# EAGLE design Movuino_Dongle_v0.94 (EAGLE 7.5.0)
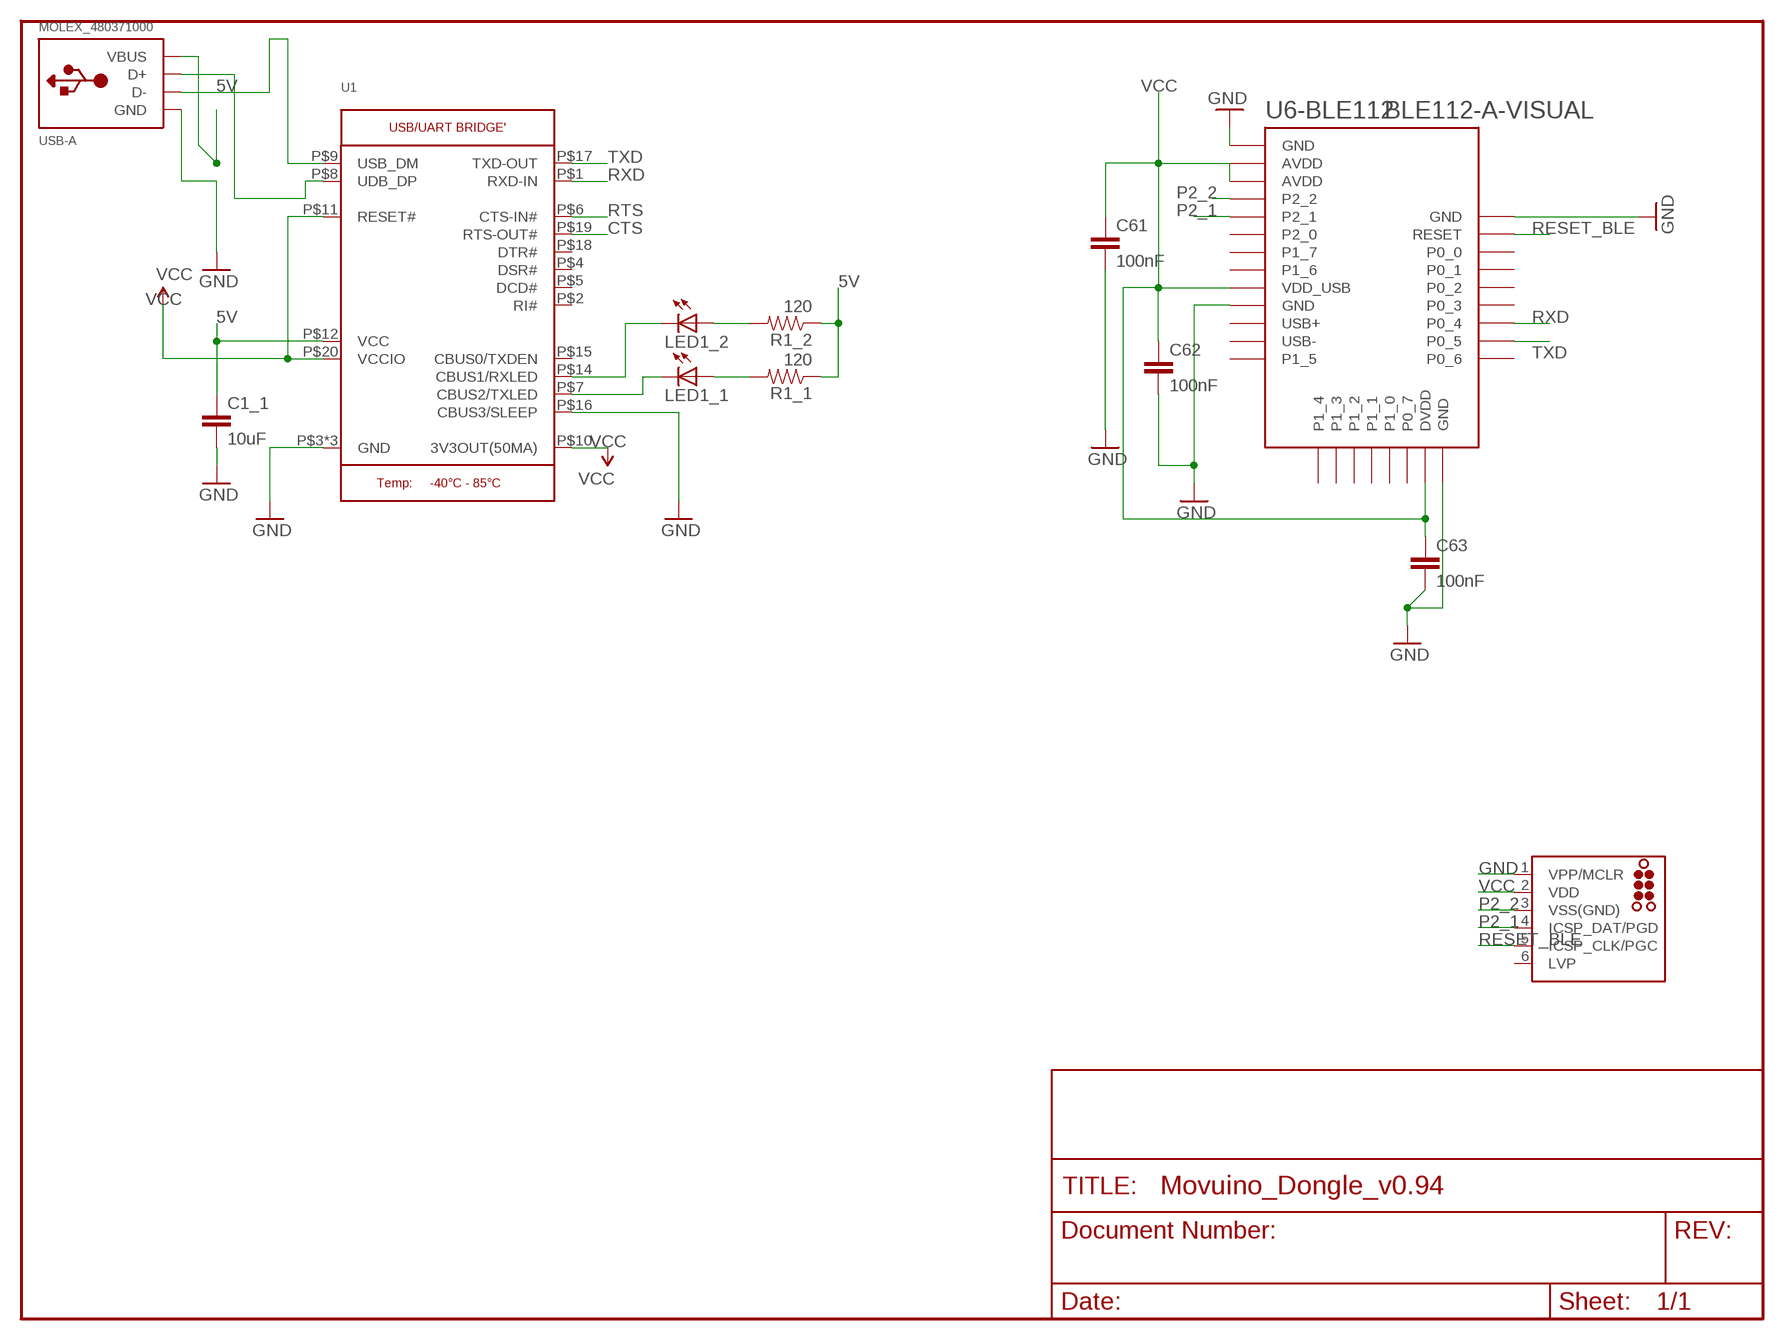
[diagram p0: schematic, sheet 1]

## Parts
C1_1  10uF  CAP0402-CAP  [0402-CAP]
C61  100nF  CAP0402-CAP  [0402-CAP]
C62  100nF  CAP0402-CAP  [0402-CAP]
C63  100nF  CAP0402-CAP  [0402-CAP]
J1  TC2030-MCP-NL  [TC2030-MCP-NL]
LED1_1  LED0603  [LED-0603]
LED1_2  LED0603  [LED-0603]
MOLEX_480371000  USB-A  [MOLEX_480371000]
R1_1  120  RESISTOR0402-RES  [0402-RES]
R1_2  120  RESISTOR0402-RES  [0402-RES]
U1  MICROBUILDER_FT231X  [MICROBUILDER_QFN20_4MM]
U6-BLE112  BLE112-A-VISUAL  [BLE112-A]

## Nets
5V: C1_1.1 MOLEX_480371000.1(VBUS) R1_1.1 R1_2.1 U1.P$12(VCC)
CTS: U1.P$19(RTS-OUT#)
GND: C1_1.2 C61.2 C62.2 C63.2 J1.1(VPP/MCLR) MOLEX_480371000.4(GND) U1.P$3(GND) U1.P$13(GND) U1.P$16(CBUS3/SLEEP) U1.P$21(GND) U6-BLE112.GND1(GND) U6-BLE112.GND2(GND) U6-BLE112.GND3(GND) U6-BLE112.GND4(GND)
N$2: MOLEX_480371000.3(D+) U1.P$8(UDB_DP)
N$7: MOLEX_480371000.2(D-) U1.P$9(USB_DM)
N$18: LED1_2.C U1.P$14(CBUS1/RXLED)
N$22: LED1_1.C U1.P$7(CBUS2/TXLED)
N$23: LED1_2.A R1_2.2
N$27: LED1_1.A R1_1.2
P2_1: J1.4(ICSP_DAT/PGD) U6-BLE112.P2_1
P2_2: J1.3(VSS(GND)) U6-BLE112.P2_2
RESET_BLE: J1.5(ICSP_CLK/PGC) U6-BLE112.RESET
RTS: U1.P$6(CTS-IN#)
RXD: U1.P$1(RXD-IN) U6-BLE112.P0_4
TXD: U1.P$17(TXD-OUT) U6-BLE112.P0_5
VCC: C61.1 C62.1 C63.1 J1.2(VDD) U1.P$10(3V3OUT(50MA)) U1.P$11(RESET#) U1.P$20(VCCIO) U6-BLE112.AVDD1(AVDD) U6-BLE112.AVDD2(AVDD) U6-BLE112.DVDD U6-BLE112.VDD_USB
Unconnected: J1.6(LVP) U1.P$2(RI#) U1.P$4(DSR#) U1.P$5(DCD#) U1.P$15(CBUS0/TXDEN) U1.P$18(DTR#) U6-BLE112.P0_0 U6-BLE112.P0_1 U6-BLE112.P0_2 U6-BLE112.P0_3 U6-BLE112.P0_6 U6-BLE112.P0_7 U6-BLE112.P1_0 U6-BLE112.P1_1 U6-BLE112.P1_2 U6-BLE112.P1_3 U6-BLE112.P1_4 U6-BLE112.P1_5 U6-BLE112.P1_6 U6-BLE112.P1_7 U6-BLE112.P2_0 U6-BLE112.USB+ U6-BLE112.USB-

## Library data of the parts
C1_1 C61-C63 = SparkFun:CAP: Capacitor Standard 0603 ceramic capacitor, and 0.1" leaded capacitor.
J1 = tag-connect:TC2030: TAG-CONNECT ICSP Connector Manufacturer: Tag-Connect <http://www.tag-connect.com> Cable for easy In-Circuit Serial Programming. Designed for Microchip ICD2, suitable for many others. Two variants - one "with legs" (for hands-free fit on PCB) and another "without legs" for quick programming. PAD Description 1 MCLR/Vpp 2 Vdd 3 GND 4 PGD (ISPDAT) 5 PGC (ISPCLK) 6 nc (used for LVP) ©2009 ROFA.cz - modified and updated by Robert Darlington ‹rdarlington@gmail.com›
LED1_1 LED1_2 = SparkFun-LED:LED: LEDs Standard schematic elements and footprints for 5mm, 3mm, 1206, and 0603 sized LEDs. 5mm - Spark Fun Electronics SKU : COM-00529 (and others)
MOLEX_480371000 = adafruit2:USB-A: USB type A 'plug' Used for things that can directly connect to a USB port, say USB key
R1_1 R1_2 = SparkFun:RESISTOR: Resistor Basic schematic elements and footprints for 0603, 1206, and PTH resistors.
U1 = FT231x:MICROBUILDER_FT231X: FT231X USB To Full Handshake UART IC
U6-BLE112 = BLE-Shield-1_0_0-B:BLE112-A-VISUAL: Bluetooth Low Energy single-mode module - Bluetooth 4.0, chip antenna

## Net classes
0 default: width 0.203 mm

## Board
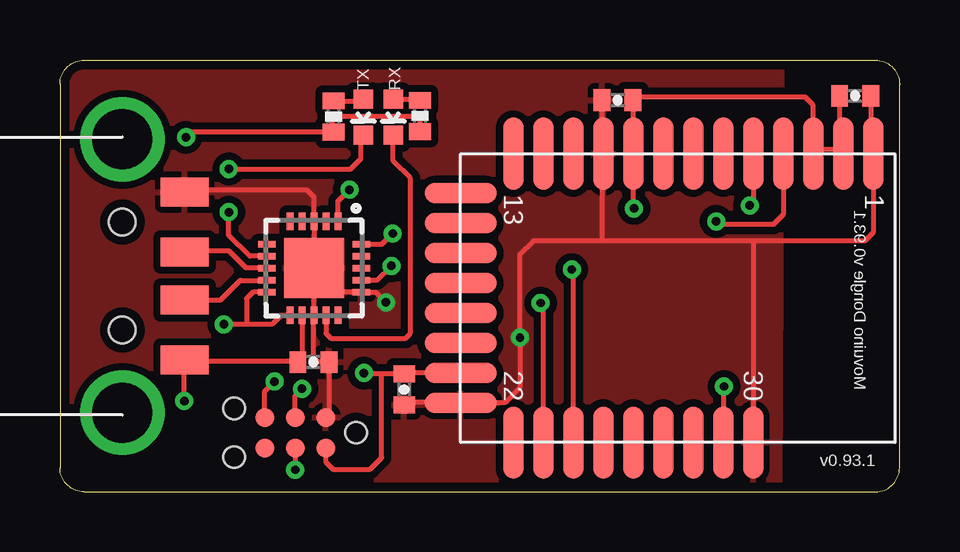
[diagram p1: board, top side]
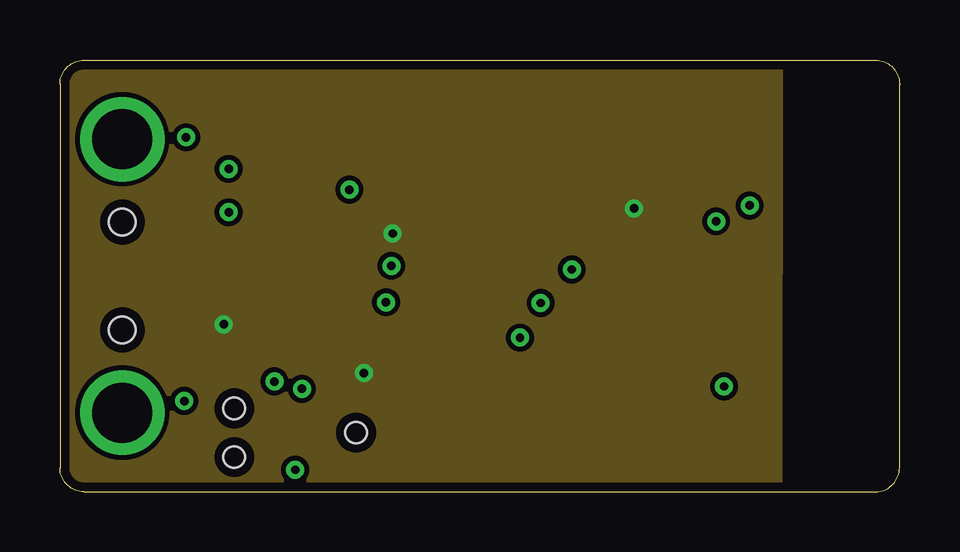
[diagram p2: board, inner layer VCC]
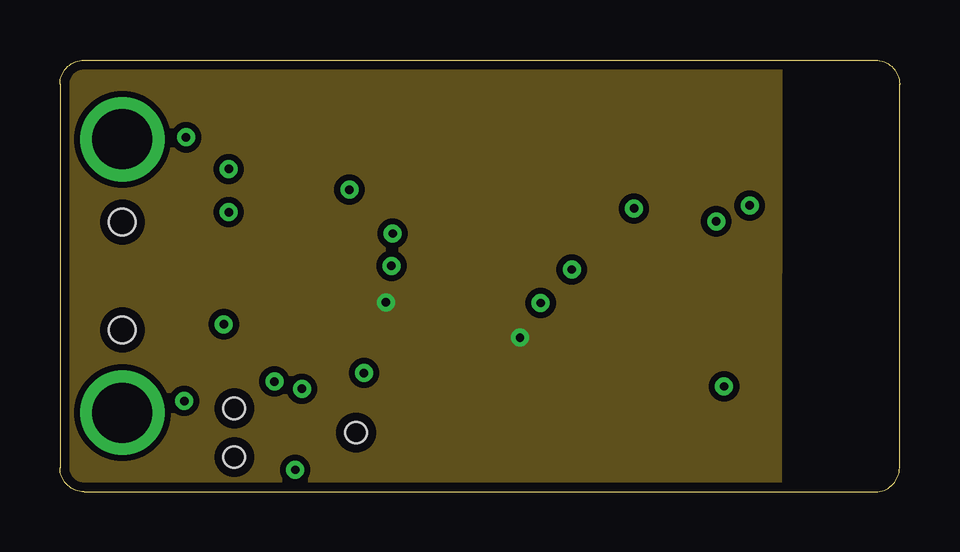
[diagram p3: board, inner layer GND]
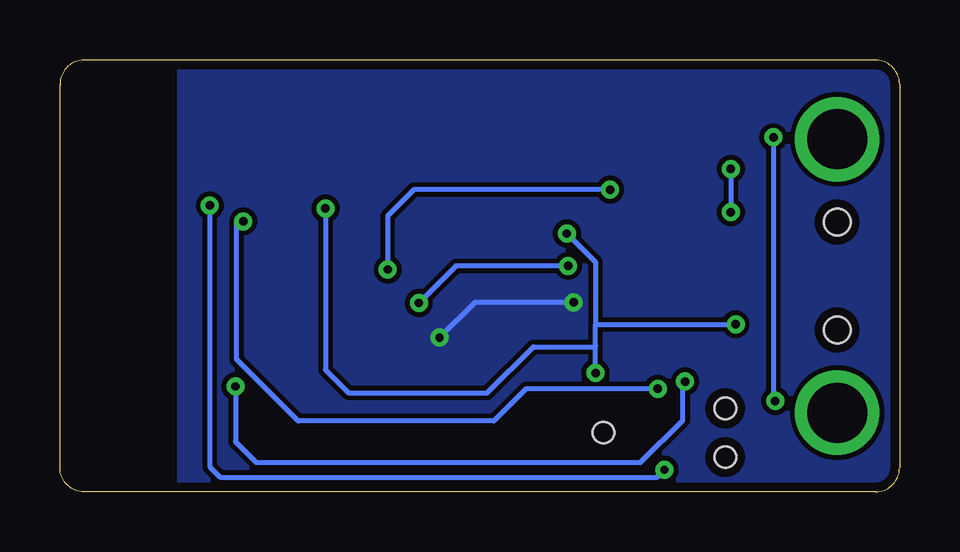
[diagram p4: board, bottom side, seen from below]

Size 35 x 18.01 mm. Coordinates in mm from the lower left corner, seen from the top.
Outline: 35,17 35,1 arc-90 34,0 1,0 arc-90 0,1 0,17 arc-90 1,18
Outline: 1,18 34,18 arc-90 35,17
Outline: 1,18 1.02,18.01
Outline: 35,17 35,16.97
Copper layers (1*2*15*16): Top 0.035mm / dielectric 0.2mm / VCC 0.0175mm / dielectric 1.1mm / GND 0.0175mm / dielectric 0.2mm / Bottom 0.035mm
Design rules "SeeedStudio_DRU_no_angle_20130527 *": minimum track width 6mil, minimum drill 12mil, track to track 6mil, track to pad 6mil, pad to pad 6mil, via to via 6mil, smd to smd 0mil, copper to edge 15mil, drill to drill 10mil, minimum pad ring 6mil, minimum via ring 6mil, stop-mask expansion 2mil, vias tented up to drill 25mil, thermal gap 10mil

### Footprints (pad centres in the part's own frame; a part is rotated, then mirrored left to right if it is on the bottom)
0402-CAP = smd 0.7 x 0.9: 1 -0.65,0; 2 0.65,0
TC2030-MCP-NL = smd 0.787 x 0.787: 1 1.27,-0.635; 2 1.27,0.635; 3 2.54,-0.635; 4 2.54,0.635; 5 3.81,-0.635; 6 3.81,0.635 | hole 0.889: 0,0; 5.08,-1.016; 5.08,1.016
LED-0603 = smd 0.8 x 0.8: A 0,-0.75; C 0,0.75
MOLEX_480371000 = smd 1.2 x 2: 1 3.5,2.6; 2 1,2.6; 3 -1,2.6; 4 -3.5,2.6 | drill 2.5: M1 -5.7,0; M2 5.7,0 | hole 1.1: -2.25,0; 2.25,0
0402-RES = smd 0.7 x 0.9: 1 -0.65,0; 2 0.65,0
MICROBUILDER_QFN20_4MM = smd 0.73 x 0.28: P$1 -1.965,1; P$2 -1.965,0.5; P$3 -1.965,0; P$4 -1.965,-0.5; P$5 -1.965,-1; P$11 1.965,-1; P$12 1.965,-0.5; P$13 1.965,0; P$14 1.965,0.5; P$15 1.965,1 | smd 0.28 x 0.73: P$6 -1,-1.965; P$7 -0.5,-1.965; P$8 0,-1.965; P$9 0.5,-1.965; P$10 1,-1.965; P$16 1,1.965; P$17 0.5,1.965; P$18 0,1.965; P$19 -0.5,1.965; P$20 -1,1.965 | smd 2.5 x 2.5: P$21 0,0
BLE112-A = smd 3 x 0.85: AVDD1 -6.05,6.9; AVDD2 -6.05,5.65; GND1 -6.05,8.15; GND2 -6.05,-3.1; GND4 6,3.15; P0_0 6,0.65; P0_1 6,-0.6; P0_2 6,-1.85; P0_3 6,-3.1; P0_4 6,-4.35; P0_5 6,-5.6; P0_6 6,-6.85; P1_5 -6.05,-6.85; P1_6 -6.05,-0.6; P1_7 -6.05,0.65; P2_0 -6.05,1.9; P2_1 -6.05,3.15; P2_2 -6.05,4.4; RESET 6,1.9; USB+ -6.05,-4.35; USB- -6.05,-5.6; VDD_USB -6.05,-1.85 | smd 0.85 x 3: DVDD 3.1,-9.05; GND3 4.35,-9.05; P0_7 1.85,-9.05; P1_0 0.6,-9.05; P1_1 -0.65,-9.05; P1_2 -1.9,-9.05; P1_3 -3.15,-9.05; P1_4 -4.4,-9.05

### Placement (x,y rotation side)
C1_1  10.57,5.41 0 top
C61  14.35,4.27 270 top
C62  33.15,16.51 0 top
C63  23.24,16.33 180 top
J1  12.34,2.46 180 top
LED1_1  12.65,15.62 180 top
LED1_2  13.89,15.62 180 top
MOLEX_480371000  2.6,9 270 top
R1_1  11.4,15.65 90 top
R1_2  15.01,15.67 90 top
U1  10.59,9.32 270 top
U6-BLE112  25.76,8.05 270 top

### Tracks (layer width: path | path; a pad name or v marks a point on that pad's centre or on a via)
5V  (via drill 0.35 pad 0.75)
  Top 0.203: C1_1.1 9.88,5.45 5.25,5.45 MOLEX_480371000.1 5.18,5.48 v5.18,3.79 | U1.P$12 10.09,5.41 C1_1.1 | C1_1.1 | R1_2.1 15.01,15.47 14.83,15.65 11.46,15.65 11.35,15.54 11.35,15.05 R1_1.1 5.47,15 v5.26,14.78
  Bottom 0.203: v5.26,14.78 5.26,3.86 v5.18,3.79
GND  (via drill 0.35 pad 0.75)
  Top 0.203: 10.59,8.56 U1.P$13 10.57,7.33 10.57,5.59 10.74,5.41 C1_1.2 11.22,3.24 J1.1 | 10.59,8.56 U1.P$21 U1.P$3 10.59,12.29 10.31,12.57 5.27,12.57 MOLEX_480371000.4 | v13.59,7.9 13.17,8.32 U1.P$16 10.83,8.32 10.59,8.56 | C61.2 14.47,3.73 15.49,3.73 15.52,3.76 16.09,3.76 U6-BLE112.GND3 18.54,3.71 19.18,4.34 v19.18,6.43 19.18,9.91 19.74,10.46 22.63,10.46 | U6-BLE112.GND4 29.03,1.93 29.03,1.45 28.93,1.55 28.93,10.39 28.85,10.46 | C63.2 22.59,14.17 | 22.59,14.17 U6-BLE112.GND2 | C62.2 33.8,14.21 U6-BLE112.GND1 33.91,10.82 33.55,10.46 28.85,10.46 | 28.85,10.46 22.63,10.46 | 22.59,14.17 22.59,10.51 22.63,10.46
  Bottom 0.203: v13.59,7.9 17.7,7.9 v19.18,6.43
  pour GND (isolate 0.254): 30,18 0,18 0,0 30,0.2
  pour Top (isolate 0.3): 30.1,17.97 0.1,17.97 0,0 30,0
  pour Bottom (isolate 0.203): 30,18.08 0,18.08 0,0 30,0
N$2
  Top 0.203: U1.P$8 8.6,9.35 7.75,9.35 7.05,10.04 5.65,10.04 MOLEX_480371000.3
N$7
  Top 0.203: MOLEX_480371000.2 6.71,8 7.52,8.81 8.62,8.81 U1.P$9
N$18
  Top 0.203: U1.P$14 11.09,6.61 11.3,6.4 14.4,6.4 14.61,6.6 14.61,13.08 13.89,13.79 LED1_2.C
N$22  (via drill 0.35 pad 0.75)
  Top 0.203: v7.04,13.46 12.12,13.46 12.55,13.89 12.55,14.77 LED1_1.C | U1.P$7 7.91,9.82 7.04,10.69 v7.04,11.66
  Bottom 0.203: v7.04,13.46 v7.04,11.66
N$23
  Top 0.203: LED1_2.A 15.09,16.37 R1_2.2
N$27
  Top 0.203: 12.65,16.42 LED1_1.A 12.57,16.3 R1_1.2
P2_1  (via drill 0.35 pad 0.75)
  Top 0.203: U6-BLE112.P2_1 28.91,12.09 v28.75,11.94 | J1.4 v9.8,0.91
  Bottom 0.203: v28.75,11.94 28.75,1.04 28.32,0.61 10.11,0.61 v9.8,0.91
P2_2  (via drill 0.35 pad 0.75)
  Top 0.203: U6-BLE112.P2_2 30.16,11.56 29.74,11.15 27.48,11.15 v27.36,11.28 | J1.3 9.8,4.01 v10.08,4.29
  Bottom 0.203: v10.08,4.29 15.57,4.29 16.92,2.95 25.07,2.95 27.64,5.51 27.64,11.18 v27.36,11.28
RESET_BLE  (via drill 0.35 pad 0.75)
  Top 0.203: U6-BLE112.RESET 27.69,2.71 v27.69,4.39 | J1.5 8.53,4.19 v8.94,4.6
  Bottom 0.203: v27.69,4.39 27.69,2.08 26.82,1.22 10.79,1.22 9.04,2.97 9.04,4.5 v8.94,4.6
RXD  (via drill 0.35 pad 0.75)
  Top 0.203: U1.P$1 11.59,12.12 v12.06,12.6 | U6-BLE112.P0_4 21.41,9.2 v21.34,9.27
  Bottom 0.203: v12.06,12.6 20.24,12.6 21.34,11.51 v21.34,9.27
TXD  (via drill 0.35 pad 0.75)
  Top 0.203: U1.P$17 13.22,8.82 v13.82,9.42 | U6-BLE112.P0_5 20.16,7.76 v20.04,7.87
  Bottom 0.203: v13.82,9.42 18.49,9.42 v20.04,7.87
VCC  (via drill 0.35 pad 0.75)
  Top 0.203: U1.P$11 9.21,7.36 8.84,6.99 7.77,6.99 | 7.77,6.99 v6.83,6.99 | 13.41,4.92 13.41,1.42 12.93,0.94 11.38,0.94 11.07,1.25 J1.2 | 14.09,5 C61.1 | 23.64,16.59 C63.1 | U6-BLE112.DVDD 14.39,4.95 C61.1 | U1.P$20 13.42,10.32 v13.87,10.77 | C61.1 13.41,4.92 | 13.41,4.92 12.71,4.92 v12.68,4.95 | C63.1 23.89,14.12 | 23.89,14.12 U6-BLE112.VDD_USB | C62.1 32.5,14.26 | 32.5,14.26 U6-BLE112.AVDD1 | 32.5,14.26 31.56,14.26 U6-BLE112.AVDD2 31.41,16.12 31.06,16.46 24.02,16.46 C63.1 | 23.89,14.12 23.89,11.86 v23.93,11.81 | U1.P$10 8.04,8.32 7.77,8.05 7.77,6.99
  Bottom 0.203: v12.68,4.95 12.68,6.07 | 12.68,6.07 12.68,6.99 | v13.87,10.77 12.68,9.58 12.68,6.99 | 12.68,6.99 v6.83,6.99 | v23.93,11.81 23.93,5.08 22.96,4.12 17.2,4.12 15.27,6.04 12.7,6.04 12.68,6.07
  pour VCC (isolate 0.203): 30,18 30,0.15 0,0 0,18

### Text on the board
tNames: TX | RX | Movuino Dongle v0.93.1 | v0.93.1